# Altium schematic sheet eps_bt1.SchDoc
size A
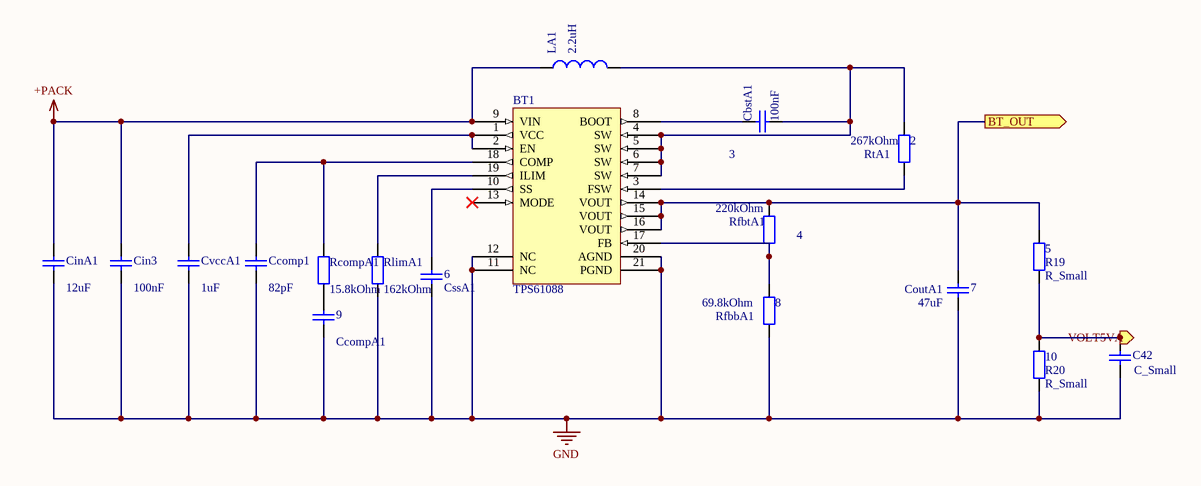
[diagram p0: eps_bt1.SchDoc]

## Parts
2  RtA1  value 267kOhm  [1608[0603]]
3  CbstA1  value 100nF  [1608[0603]]
4  RfbtA1  value 220kOhm  [1608[0603]]
5  R19  value R_Small  [1608[0603]]
6  CssA1  [1608[0603]]
7  CoutA1  value 47uF  [1608[0603]]
8  RfbbA1  value 69.8kOhm  [1608[0603]]
9  value CcompA1  [1608[0603]]
10  R20  value R_Small  [1608[0603]]
BT1  TPS61088  [QFN50P450X350X100-21N]
C42  value C_Small  [1608[0603]]
Ccomp1  value 82pF  [1608[0603]]
Cin3  value 100nF  [1608[0603]]
CinA1  value 12uF  [1608[0603]]
CvccA1  value 1uF  [1608[0603]]
LA1  value 2.2uH  [1608[0603]]
RcompA1  value 15.8kOhm  [1608[0603]]
RlimA1  value 162kOhm  [1608[0603]]

## Ports
BT_OUT (out), VOLT5VA (out)

## Nets
+PACK: BT1.9(VIN) Cin3.2 CinA1.2 LA1.1
GND: 6.1 7.1 8.1 9.1 10.1 BT1.11(NC) BT1.12(NC) BT1.20(AGND) BT1.21(PGND) C42.2 Ccomp1.1 Cin3.1 CinA1.1 CvccA1.1 RlimA1.1
BT_OUT: 4.2 5.2 7.2 BT1.14(VOUT) BT1.15(VOUT) BT1.16(VOUT) ; port BT_OUT
VOLT5VA: 5.1 10.2 C42.1 ; port VOLT5VA
Net2_1: 2.1 3.1 BT1.4(SW) BT1.5(SW) BT1.6(SW) BT1.7(SW) LA1.2
Net2_2: 2.2 BT1.3(FSW)
Net3_2: 3.2 BT1.8(BOOT)
Net4_1: 4.1 8.2 BT1.17(FB)
Net6_2: 6.2 BT1.10(SS)
Net9_2: 9.2 RcompA1.1
NetBT1_1: BT1.1(VCC) BT1.2(EN) CvccA1.2
NetBT1_18: BT1.18(COMP) Ccomp1.2 RcompA1.2
NetBT1_19: BT1.19(ILIM) RlimA1.2

Not connected (* = marked no-connect by the designer): BT1 13(MODE)*

## Library data of the parts
2 4 5 8 10 RcompA1 RlimA1 = Res2: Resistor; Published: 8-Jun-2000; LatestRevisionDate: 17-Jul-2002; LatestRevisionNote: Re-released for DXP Platform.; PackageReference: AXIAL-0.4; Publisher: Altium Limited; PackageDescription: Axial Device, Thru-Hole; 2 Leads; 0.4 in Pin Spacing
3 6 7 9 C42 Ccomp1 Cin3 CinA1 CvccA1 = Cap: Capacitor; Published: 8-Jun-2000; LatestRevisionDate: 17-Jul-2002; LatestRevisionNote: Re-released for DXP Platform.; PackageReference: RAD-0.3; Publisher: Altium Limited; PackageDescription: Radial Cap, Thru-Hole; 2 Leads; 0.3 in Pin Spacing
BT1 = TPS61088: Boost converter
LA1 = Inductor: Code_IEC: 1005; Published: 8-Jun-2000; LatestRevisionDate: 29-May-2009; LatestRevisionNote: IPC-7351 Footprint Added.; PackageReference: 0402-A; Publisher: Altium Limited; PackageDescription: Chip Inductor; Code_JEITA: 0402